# Altium schematic sheet [5]-CONNECTORS.SchDoc
size A4
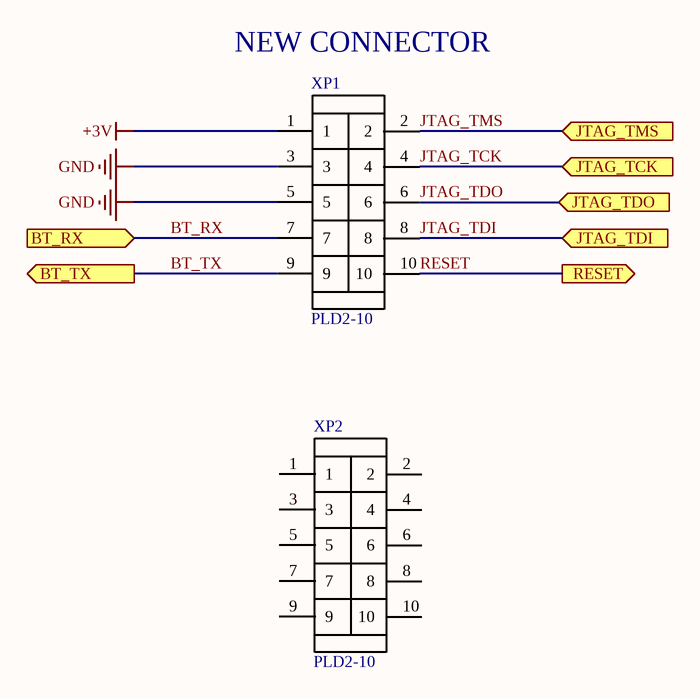
[diagram p0: [5]-CONNECTORS.SchDoc]

## Parts
XP1  PLD2-10  [PLD2-10]
XP2  PLD2-10  [PLD2-10]

## Ports
BT_RX (in), BT_TX (out), JTAG_TCK (in), JTAG_TDI (in), JTAG_TDO (in), JTAG_TMS (in), RESET (out)

## Nets
+3V: XP1.1
GND: XP1.3 XP1.5
BT_RX: XP1.7 ; port BT_RX
BT_TX: XP1.9 ; port BT_TX
JTAG_TCK: XP1.4 ; port JTAG_TCK
JTAG_TDI: XP1.8 ; port JTAG_TDI
JTAG_TDO: XP1.6 ; port JTAG_TDO
JTAG_TMS: XP1.2 ; port JTAG_TMS
RESET: XP1.10 ; port RESET

Not connected (* = marked no-connect by the designer): XP2 1 2 3 4 5 6 7 8 9 10

## Notes on the sheet
- (near XP1) NEW CONNECTOR

## Library data of the parts
XP1 XP2 = PLD2-10: Value: PLD2-10